# Altium schematic sheet PowerInput&Switch.SchDoc
size A; DocumentNumber: 2; SheetNumber: 2; SheetTotal: 7
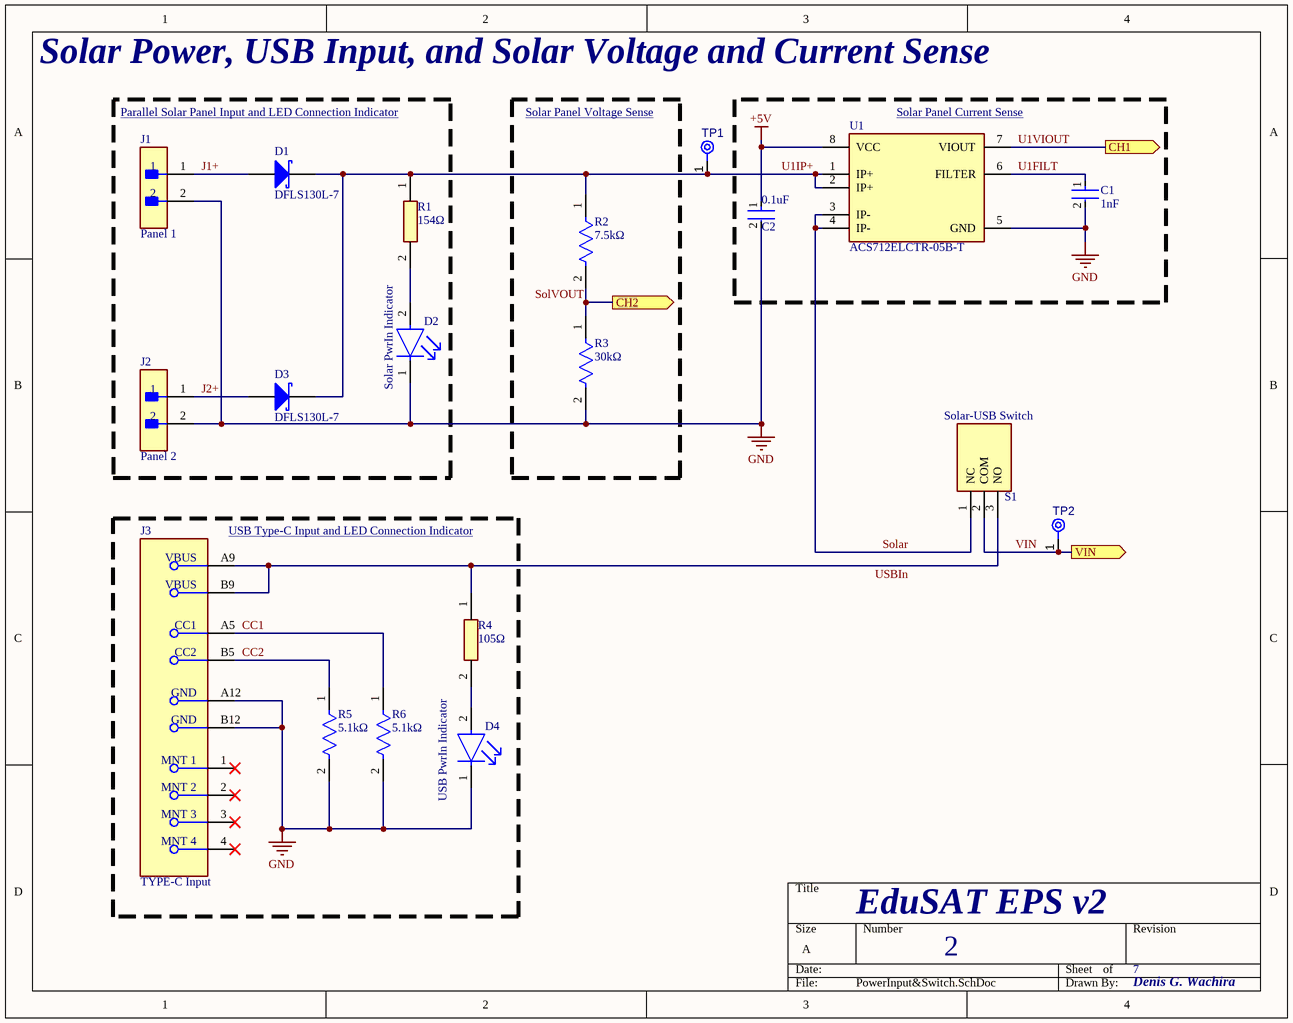
[diagram p0: PowerInput&Switch.SchDoc]

## Parts
C1  1nF  [FP-CL21-IPC_B]
C2  0.1uF  [FP-CL21-IPC_A]
D1  DFLS130L-7  [DIOD-POWERDI123-2_A_V]
D2  Solar PwrIn Indicator  [FP-LTST-C170GKT-MFG]
D3  DFLS130L-7  [DIOD-POWERDI123-2_A_V]
D4  USB PwrIn Indicator  [FP-LTST-C170GKT-MFG]
J1  Panel 1  [FP-S2B-XH-A-1_LF_SN-MFG]
J2  Panel 2  [FP-S2B-XH-A-1_LF_SN-MFG]
J3  TYPE-C Input  [FP-USB4125-GF-A-0190-MFG]
R1  154Ω  [RESC2012X65N]
R2  7.5kΩ  [FP-MCR10-IPC_A]
R3  30kΩ  [FP-MCR10-IPC_A]
R4  105Ω  [RESC2012X65N]
R5  5.1kΩ  [FP-MCR10-IPC_A]
R6  5.1kΩ  [FP-MCR10-IPC_A]
S1  Solar-USB Switch  [SS12D10L3]
TP1  TPAD6R  [TP06R]  (value not drawn)  (no BOM)
TP2  TPAD6R  [TP06R]  (value not drawn)  (no BOM)
U1  ACS712ELCTR-05B-T  [FP-LC-8-IPC_A]

## Blocks framed on the sheet
Parallel Solar Panel Input and LED Connection Indicator: D1-D3 J1 J2 R1
Solar Panel Voltage Sense: R2 R3
Solar Panel Current Sense: C1 C2 U1
USB Type-C Input and LED Connection Indicator: D4 J3 R4-R6

## Ports
CH1 (out, see EduSAT-EPSv2[2B], PowerOutput&Switch[3B]), CH2 (out, see EduSAT-EPSv2[2B], PowerOutput&Switch[3A]), VIN (out, see EduSAT-EPSv2[2B], Charging&1AOut1[1A], Charging&1AOut2[1A], Charging&1AOut3[1A])

## Nets
+5V: C2.1 U1.8(VCC)
GND: C1.2 C2.2 D2.1(C) D4.1(C) J1.2 J2.2 J3.A12(GND) J3.B12(GND) R3.2 R5.2 R6.2 U1.5(GND)
CC1: J3.A5(CC1) R6.1
CC2: J3.B5(CC2) R5.1
J1+: D1.1(A) J1.1
J2+: D3.1(A) J2.1
Solar: S1.1(NC) U1.3(IP-) U1.4(IP-)
SolVOUT: R2.2 R3.1 ; port CH2
U1FILT: C1.1 U1.6(FILTER)
U1IP+: D1.2(K) D3.2(K) R1.1 R2.1 TP1.1(TP) U1.1(IP+) U1.2(IP+)
U1VIOUT: U1.7(VIOUT) ; port CH1
USBIn: J3.A9(VBUS) J3.B9(VBUS) R4.1 S1.3(NO)
VIN: S1.2(COM) TP2.1(TP) ; port VIN
NetD2_2: D2.2(A) R1.2
NetD4_2: D4.2(A) R4.2

Not connected (* = marked no-connect by the designer): J3 1(MNT_1)* 2(MNT_2)* 3(MNT_3)* 4(MNT_4)*

## Notes on the sheet
- Solar Power, USB Input, and Solar Voltage and Current Sense
- EduSAT EPS v2
- Denis G. Wachira

## Library data of the parts
C1 = CMP-13271-001800-1: CL21 Series 0805 1nF 50V ±10% Tolerance X7R Multilayer Ceramic Chip Capacitor / CGA0805X7R102K500KT; Contact Plating: Tin; Tolerance: 10%; Package Quantity: 4000; Voltage: 50V; Mount: Surface Mount; Material: Ceramic; Width: 0.049inch; Capacitance: 1nF; Case Code (Metric): 2012; Case Code (Imperial): 0805; Height: 0.65mm; Max Operating Temperature: 125°C; Thickness: 0.03inch; Length: 2mm; Radiation Hardening: No; Depth: 1.25mm; Packaging: Tape and Reel; Voltage Rating: 50V; Dielectric: X7R; Min Operating Temperature: -55°C; Case/Package: 0805
C2 = CMP-13271-002975-1: 50V 0.1uF X7R ±10% 0805 Multilayer Ceramic Capacitors MLCC - SMD/SMT ROHS TCC0805X7R104K500DT; Case Code (Imperial): 0805; Length: 2mm; Case/Package: 0805; Packaging: Tape and Reel; Width: 0.049inch; Tolerance: 10%; Mount: Surface Mount; Min Operating Temperature: -55°C; Thickness: 0.057inch; Height: 1.25mm; Dielectric: X7R; Package Quantity: 1; Depth: 1.25mm; Capacitance: 0.1uF; Voltage Rating: 50V; Case Code (Metric): 2012; Max Operating Temperature: 85°C; Radiation Hardening: No
D1 D3 = CMP-2000-07448-1: Schottky Barrier Rectifier, 30 V, 1 A, -40 to 125 degC, 2-Pin SMD, RoHS, Tape and Reel; Manufacturer: Diodes Inc; Max Repetitive Reverse Voltage (Vrrm): 30V; Polarity: Standard; Average Rectified Current: 1A; Element Configuration: Single; Forward Voltage: 360mV; Peak Non-Repetitive Surge Current: 50A; Max Power Dissipation: 1.67W; Case\/Package: SMD/SMT; Capacitance: 76pF; Peak Reverse Current: 1mA; Datasheet URL: https://www.diodes.com/assets/Datasheets/ds30492.pdf; Package Quantity: 3000; Reverse Voltage (DC): 30V; Package Reference: POWERDI123-2_A; Lead Free: LeadFree; Mounting Technology: SurfaceMount; Max Operating Temperature: 125degC; Current Rating: 1A; Radiation Hardening: No; Width: 1.78mm; Height: 0.98mm; Output Current: 1A; Contact Plating: Matte; Length: 2.8mm; Number of Pins: 2; Voltage Rating (DC): 30V; RoHSCompliant: true; Termination: SMD/SMT; Forward Current: 1A; Min Operating Temperature: -40degC; Datasheet Version: Rev. 4-2, 06/2009; Packaging: TapeandReel; REACH SVHC: NoSVHC; Max Forward Surge Current (Ifsm): 50A; Manufacturer URL: http://www.diodes.com/; Mount: SurfaceMount; Package Description: 2-Pin Small Outline Diode, Body 2.8 x 1.78 mm
D2 D4 = CMP-1674-00002-6: LED GREEN CLEAR SMD KT-0805G; Dominant Wavelength: 569nm; Lens Style: Diffused; Forward Voltage: 2.1V; Number of Elements: 1; Wavelength: 565nm; Luminous Intensity: 6mcd; Test Current: 10mA; Power Dissipation: 100mW; Reverse Voltage: 5V; Forward Current: 30mA; Viewing Angle: 130°; Lens Color: Colorless; Min Operating Temperature: -55°C; Number of Pins: 2; Max Operating Temperature: 85°C; Color: Green; Radiation Hardening: No; Illumination Color: Green; Case Code (Metric): 2012; Lens Transparency: Clear; Case/Package: 0805; Width: 1.25mm; Case Code (Imperial): 0805; Package Quantity: 1; Height: 1.1mm; Depth: 1.25mm; Length: 2mm; Power Rating: 100mW; Lead Free: Lead Free; Number of LEDs: 1; Packaging: Tape and Reel; Mount: Surface Mount; Voltage: 5V
J1 J2 = CMP-17439-000260-1: CONN HEADER R/A 2POS 2.5MM HCZZ0139-2; Voltage Rating: 250V; Number of Positions: 2; Contact Material: Brass; Series: XH; Contact Finish - Mating: TIN; Max Operating Temperature: 85°C; Number of Rows: 1; Packaging: Bulk; Insulation Color: Natural; Lead Free: Lead Free; Fastening Type: Detent; Termination: Press-Fit; Connector Type: Header; Insulation Material: Nylon; Contact Shape: Square; Contact Type: Male Pin; Mount: Through Hole; Min Operating Temperature: -25°C; Flammability Rating: UL94 V-0
J3 = CMP-002-00079-1: 3A 1 Surface Mount，Right Angle 6P Female -40℃~+85℃ Type-C SMD USB Connectors ROHS; Voltage Rating: 20V; RoHS Compliant: Yes; Pins: 6P; Mounting Technology: Surface Mount, Right Angle; Connector Type: Type-C; Gender: Female; Min Operating Temperature: -40°C; Max Operating Temperature: 85°C; Max Current Rating: 3A
R1 = AECR0805F27R0K9: 125mW Thick Film Resistors 150V ±100ppm/℃ ±1% 154Ω 0805 Chip Resistor - Surface Mount ROHS CR0805F81540G; Manufacturer_Name: ResistorToday; Datasheet Link: https://datasheet.lcsc.com/lcsc/2304140030_RESI-AECR0805F27R0K9_C352233.pdf; Height: 0.65mm; Manufacturer_Part_Number: AECR0805F27R0K9
R2 = CMP-08839-023103-1: Thick Film Chip Resistor, 0805, 7.5kΩ, 1%, 100ppm/°C, 0.125W, 150V 0805W8F7501T5E; Power Rating: 125mW; Resistance: 1kR; Max Operating Temperature: 155°C; Length: 0.079inch; Case/Package: 0805; Tolerance: 1%; Mount: Surface Mount; Packaging: Tape and Reel; Number of Terminations: 2; Voltage Rating (DC): 150V; RoHS Compliant: Yes; Case Code (Metric): 2012; Lead Free: Lead Free; Max Power Dissipation: 125mW; Height: 0.024inch; Temperature Coefficient: 100ppm/°C; Resistor Type: Thick Film; Case Code (Imperial): 0805; Package Quantity: 5000; Contact Plating: Tin; Width: 0.049inch; Min Operating Temperature: -55°C
R3 = CMP-08839-023103-1: Thick Film Chip Resistor, 0805, 30kΩ, 1%, 100ppm/°C, 0.125W, 150V 0805W8F7501T5E; Power Rating: 125mW; Resistance: 1kR; Max Operating Temperature: 155°C; Length: 0.079inch; Case/Package: 0805; Tolerance: 1%; Mount: Surface Mount; Packaging: Tape and Reel; Number of Terminations: 2; Voltage Rating (DC): 150V; RoHS Compliant: Yes; Case Code (Metric): 2012; Lead Free: Lead Free; Max Power Dissipation: 125mW; Height: 0.024inch; Temperature Coefficient: 100ppm/°C; Resistor Type: Thick Film; Case Code (Imperial): 0805; Package Quantity: 5000; Contact Plating: Tin; Width: 0.049inch; Min Operating Temperature: -55°C
R4 = AECR0805F27R0K9: 125mW Thick Film Resistors 150V ±100ppm/℃ ±1% 105Ω 0805 Chip Resistor - Surface Mount ROHS CR0805F105RP05Z; Manufacturer_Name: ResistorToday; Datasheet Link: https://datasheet.lcsc.com/lcsc/2304140030_RESI-AECR0805F27R0K9_C352233.pdf; Height: 0.65mm; Manufacturer_Part_Number: AECR0805F27R0K9
R5 R6 = CMP-08839-023103-1: Thick Film Chip Resistor, 0805, 5.1kΩ, 1%, 100ppm/°C, 0.125W, 150V 0805W8F5101T5E; Power Rating: 125mW; Resistance: 1kR; Max Operating Temperature: 155°C; Length: 0.079inch; Case/Package: 0805; Tolerance: 1%; Mount: Surface Mount; Packaging: Tape and Reel; Number of Terminations: 2; Voltage Rating (DC): 150V; RoHS Compliant: Yes; Case Code (Metric): 2012; Lead Free: Lead Free; Max Power Dissipation: 125mW; Height: 0.024inch; Temperature Coefficient: 100ppm/°C; Resistor Type: Thick Film; Case Code (Imperial): 0805; Package Quantity: 5000; Contact Plating: Tin; Width: 0.049inch; Min Operating Temperature: -55°C
S1 = SS-12D10L3: Switch; Manufacturer_Name: XKB Connectivity; Datasheet Link: http://www.helloxkb.com/public/images/pdf/SS-12D10XXX.pdf; Height: 9.6mm; Manufacturer_Part_Number: SS-12D10L3
TP1 TP2 = CMP-00028-00002-2: 0.6mm round; Pins: 1
U1 = CMP-2000-04989-2: SENSOR CURRENT HALL 5A AC/DC; Output Current: 10mA; Response Time: 5us; Number of Channels: 1; Sensitivity: 185mV/A; Polarity: Bidirectional; Linearity: 1.5%; Max Supply Current: 13mA; Frequency: 80kHz; Max Supply Voltage: 5.5V; Min Supply Voltage: 4.5V; Voltage: 5V; Mount: Surface Mount; Max Operating Temperature: 85°C; Min Operating Temperature: -40°C; Termination: SMD/SMT; Number of Pins: 8; Accuracy: 1.5%; Current Sensing: 5A; Length: 4.9mm; Package Quantity: 1; REACH SVHC: No SVHC; Packaging: Cut Tape; Series: -; Height: 1.5mm; Width: 3.9mm; Operating Supply Voltage: 5V; Bandwidth: 80kHz; Case/Package: SOIC; Lead Free: Lead Free; Quiescent Current: 10mA; RoHS Compliant: Yes